# EAGLE schematic io (EAGLE 6.6.0)

## Sheet 1 of 2
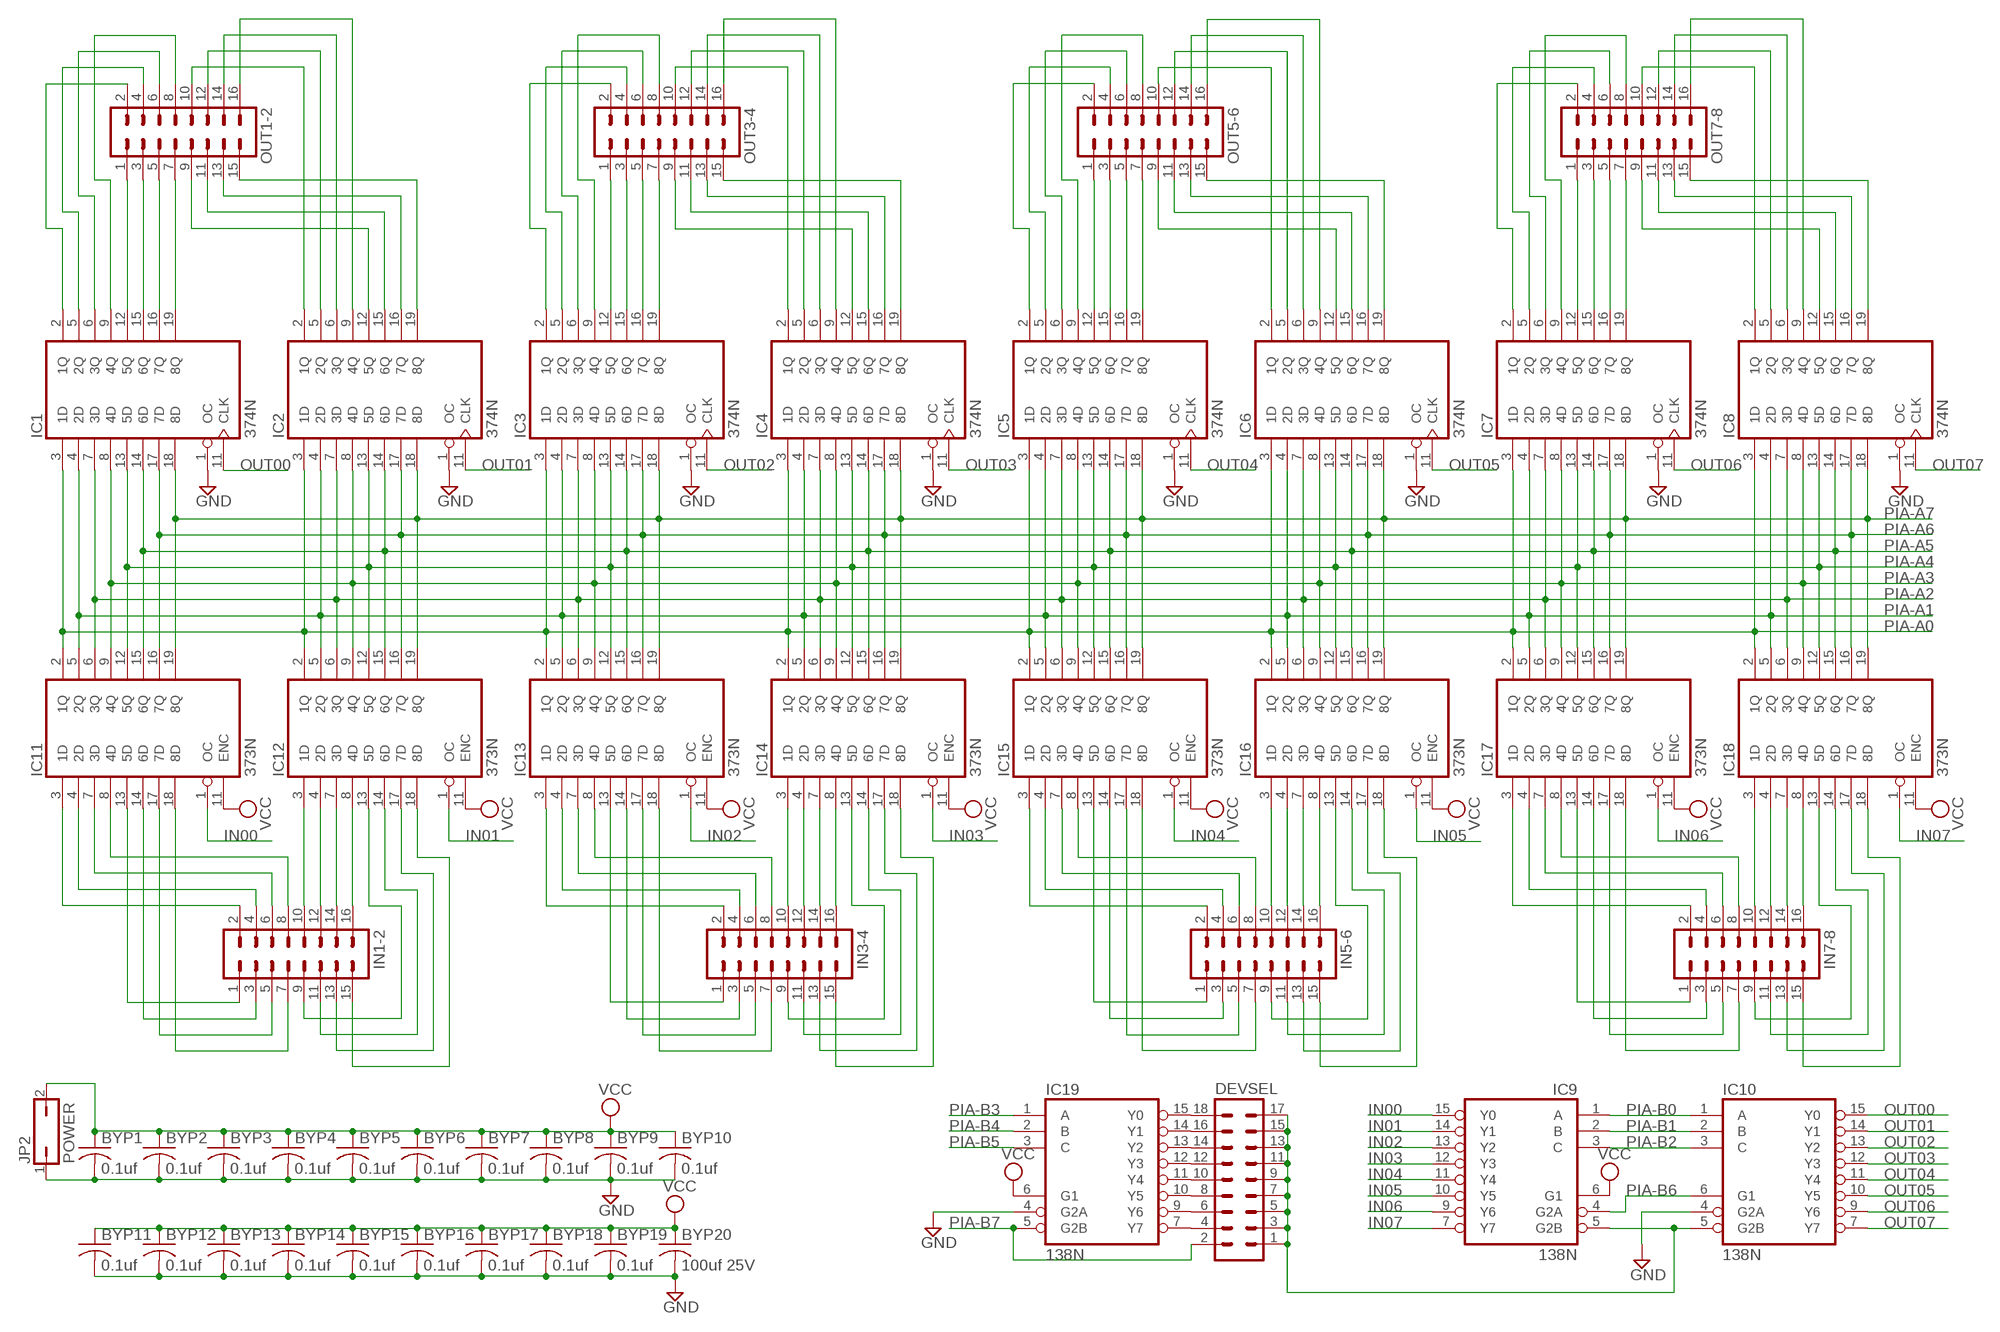
[diagram p0: schematic, sheet 1]

### Parts
BYP1  0.1uf  C-US050-025X075  [C050-025X075]
BYP2  0.1uf  C-US050-025X075  [C050-025X075]
BYP3  0.1uf  C-US050-025X075  [C050-025X075]
BYP4  0.1uf  C-US050-025X075  [C050-025X075]
BYP5  0.1uf  C-US050-025X075  [C050-025X075]
BYP6  0.1uf  C-US050-025X075  [C050-025X075]
BYP7  0.1uf  C-US050-025X075  [C050-025X075]
BYP8  0.1uf  C-US050-025X075  [C050-025X075]
BYP9  0.1uf  C-US050-025X075  [C050-025X075]
BYP10  0.1uf  C-US050-025X075  [C050-025X075]
BYP11  0.1uf  C-US050-025X075  [C050-025X075]
BYP12  0.1uf  C-US050-025X075  [C050-025X075]
BYP13  0.1uf  C-US050-025X075  [C050-025X075]
BYP14  0.1uf  C-US050-025X075  [C050-025X075]
BYP15  0.1uf  C-US050-025X075  [C050-025X075]
BYP16  0.1uf  C-US050-025X075  [C050-025X075]
BYP17  0.1uf  C-US050-025X075  [C050-025X075]
BYP18  0.1uf  C-US050-025X075  [C050-025X075]
BYP19  0.1uf  C-US050-025X075  [C050-025X075]
BYP20  100uf 25V  C-US150-064X183  [C150-064X183]
DEVSEL  MA09-2  [MA09-2]
IC1  374N  74LS374N  [DIL20]
IC2  374N  74LS374N  [DIL20]
IC3  374N  74LS374N  [DIL20]
IC4  374N  74LS374N  [DIL20]
IC5  374N  74LS374N  [DIL20]
IC6  374N  74LS374N  [DIL20]
IC7  374N  74LS374N  [DIL20]
IC8  374N  74LS374N  [DIL20]
IC9  138N  74LS138N  [DIL16]
IC10  138N  74LS138N  [DIL16]
IC11  373N  74LS373N  [DIL20]
IC12  373N  74LS373N  [DIL20]
IC13  373N  74LS373N  [DIL20]
IC14  373N  74LS373N  [DIL20]
IC15  373N  74LS373N  [DIL20]
IC16  373N  74LS373N  [DIL20]
IC17  373N  74LS373N  [DIL20]
IC18  373N  74LS373N  [DIL20]
IC19  138N  74LS138N  [DIL16]
IN1-2  MA08-2  [MA08-2]
IN3-4  MA08-2  [MA08-2]
IN5-6  MA08-2  [MA08-2]
IN7-8  MA08-2  [MA08-2]
JP2  POWER  JP1Q  [JP1]
OUT1-2  MA08-2  [MA08-2]
OUT3-4  MA08-2  [MA08-2]
OUT5-6  MA08-2  [MA08-2]
OUT7-8  MA08-2  [MA08-2]

### Nets
GND [Power]: BYP1.2 BYP2.2 BYP3.2 BYP4.2 BYP5.2 BYP6.2 BYP7.2 BYP8.2 BYP9.2 BYP10.2 BYP11.2 BYP12.2 BYP13.2 BYP14.2 BYP15.2 BYP16.2 BYP17.2 BYP18.2 BYP19.2 BYP20.2 IC1.1(OC) IC2.1(OC) IC3.1(OC) IC4.1(OC) IC5.1(OC) IC6.1(OC) IC7.1(OC) IC8.1(OC) IC10.4(G2A) IC19.4(G2A) JP2.1 ; also sheet 2
IN00: IC9.15(Y0) IC11.1(OC)
IN01: IC9.14(Y1) IC12.1(OC)
IN02: IC9.13(Y2) IC13.1(OC)
IN03: IC9.12(Y3) IC14.1(OC)
IN04: IC9.11(Y4) IC15.1(OC)
IN05: IC9.10(Y5) IC16.1(OC)
IN06: IC9.9(Y6) IC17.1(OC)
IN07: IC9.7(Y7) IC18.1(OC)
N$1: IC12.3(1D) IN1-2.10
N$2: IC12.4(2D) IN1-2.12
N$3: DEVSEL.18 IC19.15(Y0)
N$4: DEVSEL.16 IC19.14(Y1)
N$5: DEVSEL.14 IC19.13(Y2)
N$6: DEVSEL.12 IC19.12(Y3)
N$7: IC12.7(3D) IN1-2.14
N$8: IC12.8(4D) IN1-2.16
N$9: IC11.8(4D) IN1-2.8
N$10: IC11.7(3D) IN1-2.6
N$11: IC11.4(2D) IN1-2.4
N$12: IC11.3(1D) IN1-2.2
N$13: IC11.13(5D) IN1-2.1
N$14: IC11.14(6D) IN1-2.3
N$15: IC11.17(7D) IN1-2.5
N$16: IC11.18(8D) IN1-2.7
N$17: IC12.13(5D) IN1-2.9
N$18: IC12.14(6D) IN1-2.11
N$19: IC12.17(7D) IN1-2.13
N$20: IC12.18(8D) IN1-2.15
N$21: DEVSEL.10 IC19.11(Y4)
N$22: DEVSEL.8 IC19.10(Y5)
N$23: DEVSEL.6 IC19.9(Y6)
N$24: DEVSEL.4 IC19.7(Y7)
N$25: DEVSEL.1 DEVSEL.3 DEVSEL.5 DEVSEL.7 DEVSEL.9 DEVSEL.11 DEVSEL.13 DEVSEL.15 DEVSEL.17 IC9.5(G2B) IC10.5(G2B)
N$26: IC5.2(1Q) OUT5-6.2
N$27: IC18.8(4D) IN7-8.16
N$28: IC18.3(1D) IN7-8.10
N$29: IC14.3(1D) IN3-4.10
N$30: IC14.4(2D) IN3-4.12
N$31: IC14.7(3D) IN3-4.14
N$32: IC14.8(4D) IN3-4.16
N$33: IC3.12(5Q) OUT3-4.1
N$34: IC3.15(6Q) OUT3-4.3
N$35: IC3.16(7Q) OUT3-4.5
N$36: IC3.19(8Q) OUT3-4.7
N$37: IC13.3(1D) IN3-4.2
N$38: IC13.4(2D) IN3-4.4
N$39: IC13.7(3D) IN3-4.6
N$40: IC13.8(4D) IN3-4.8
N$41: IC14.13(5D) IN3-4.9
N$42: IC14.14(6D) IN3-4.11
N$43: IC14.17(7D) IN3-4.13
N$44: IC14.18(8D) IN3-4.15
N$45: IC13.13(5D) IN3-4.1
N$46: IC13.14(6D) IN3-4.3
N$47: IC13.17(7D) IN3-4.5
N$48: IC13.18(8D) IN3-4.7
N$49: IC3.5(2Q) OUT3-4.4
N$50: IC3.6(3Q) OUT3-4.6
N$51: IC3.2(1Q) OUT3-4.2
N$52: IC3.9(4Q) OUT3-4.8
N$53: IC1.12(5Q) OUT1-2.1
N$54: IC1.15(6Q) OUT1-2.3
N$55: IC1.16(7Q) OUT1-2.5
N$56: IC1.19(8Q) OUT1-2.7
N$57: IC1.2(1Q) OUT1-2.2
N$58: IC1.5(2Q) OUT1-2.4
N$59: IC1.6(3Q) OUT1-2.6
N$60: IC1.9(4Q) OUT1-2.8
N$61: IC2.19(8Q) OUT1-2.15
N$62: IC2.16(7Q) OUT1-2.13
N$63: IC2.15(6Q) OUT1-2.11
N$64: IC2.12(5Q) OUT1-2.9
N$65: IC2.2(1Q) OUT1-2.10
N$66: IC2.5(2Q) OUT1-2.12
N$67: IC2.6(3Q) OUT1-2.14
N$68: IC2.9(4Q) OUT1-2.16
N$69: IC4.2(1Q) OUT3-4.10
N$70: IC4.5(2Q) OUT3-4.12
N$71: IC4.6(3Q) OUT3-4.14
N$72: IC4.9(4Q) OUT3-4.16
N$73: IC4.19(8Q) OUT3-4.15
N$74: IC4.16(7Q) OUT3-4.13
N$75: IC4.15(6Q) OUT3-4.11
N$76: IC4.12(5Q) OUT3-4.9
N$77: IC16.3(1D) IN5-6.10
N$78: IC16.4(2D) IN5-6.12
N$79: IC16.7(3D) IN5-6.14
N$80: IC16.8(4D) IN5-6.16
N$81: IC5.12(5Q) OUT5-6.1
N$82: IC5.15(6Q) OUT5-6.3
N$83: IC5.16(7Q) OUT5-6.5
N$84: IC5.19(8Q) OUT5-6.7
N$85: IC7.12(5Q) OUT7-8.1
N$86: IC7.15(6Q) OUT7-8.3
N$87: IC7.16(7Q) OUT7-8.5
N$88: IC7.19(8Q) OUT7-8.7
N$89: IC5.5(2Q) OUT5-6.4
N$90: IC5.6(3Q) OUT5-6.6
N$91: IC5.9(4Q) OUT5-6.8
N$92: IC6.12(5Q) OUT5-6.9
N$93: IC6.15(6Q) OUT5-6.11
N$94: IC18.4(2D) IN7-8.12
N$95: IC6.16(7Q) OUT5-6.13
N$96: IC6.19(8Q) OUT5-6.15
N$97: IC6.2(1Q) OUT5-6.10
N$98: IC6.5(2Q) OUT5-6.12
N$99: IC6.6(3Q) OUT5-6.14
N$100: IC6.9(4Q) OUT5-6.16
N$101: IC15.3(1D) IN5-6.2
N$102: IC15.4(2D) IN5-6.4
N$103: IC15.7(3D) IN5-6.6
N$104: IC15.8(4D) IN5-6.8
N$105: IC16.13(5D) IN5-6.9
N$106: IC16.14(6D) IN5-6.11
N$107: IC16.17(7D) IN5-6.13
N$108: IC16.18(8D) IN5-6.15
N$109: IC15.13(5D) IN5-6.1
N$110: IC15.14(6D) IN5-6.3
N$111: IC15.17(7D) IN5-6.5
N$112: IC15.18(8D) IN5-6.7
N$113: IC8.19(8Q) OUT7-8.15
N$114: IC8.16(7Q) OUT7-8.13
N$115: IC8.15(6Q) OUT7-8.11
N$116: IC8.12(5Q) OUT7-8.9
N$117: IC8.2(1Q) OUT7-8.10
N$118: IC8.5(2Q) OUT7-8.12
N$119: IC8.6(3Q) OUT7-8.14
N$120: IC8.9(4Q) OUT7-8.16
N$121: IC7.9(4Q) OUT7-8.8
N$122: IC7.6(3Q) OUT7-8.6
N$123: IC7.5(2Q) OUT7-8.4
N$124: IC18.7(3D) IN7-8.14
N$125: IC18.13(5D) IN7-8.9
N$126: IC18.14(6D) IN7-8.11
N$127: IC18.17(7D) IN7-8.13
N$128: IC18.18(8D) IN7-8.15
N$129: IC17.3(1D) IN7-8.2
N$130: IC17.4(2D) IN7-8.4
N$131: IC17.7(3D) IN7-8.6
N$132: IC17.8(4D) IN7-8.8
N$133: IC17.13(5D) IN7-8.1
N$134: IC17.14(6D) IN7-8.3
N$135: IC17.17(7D) IN7-8.5
N$136: IC17.18(8D) IN7-8.7
N$137: IC7.2(1Q) OUT7-8.2
OUT00: IC1.11(CLK) IC10.15(Y0)
OUT01: IC2.11(CLK) IC10.14(Y1)
OUT02: IC3.11(CLK) IC10.13(Y2)
OUT03: IC4.11(CLK) IC10.12(Y3)
OUT04: IC5.11(CLK) IC10.11(Y4)
OUT05: IC6.11(CLK) IC10.10(Y5)
OUT06: IC7.11(CLK) IC10.9(Y6)
OUT07: IC8.11(CLK) IC10.7(Y7)
PIA-A0: IC1.3(1D) IC2.3(1D) IC3.3(1D) IC4.3(1D) IC5.3(1D) IC6.3(1D) IC7.3(1D) IC8.3(1D) IC11.2(1Q) IC12.2(1Q) IC13.2(1Q) IC14.2(1Q) IC15.2(1Q) IC16.2(1Q) IC17.2(1Q) IC18.2(1Q) ; also sheet 2
PIA-A1: IC1.4(2D) IC2.4(2D) IC3.4(2D) IC4.4(2D) IC5.4(2D) IC6.4(2D) IC7.4(2D) IC8.4(2D) IC11.5(2Q) IC12.5(2Q) IC13.5(2Q) IC14.5(2Q) IC15.5(2Q) IC16.5(2Q) IC17.5(2Q) IC18.5(2Q) ; also sheet 2
PIA-A2: IC1.7(3D) IC2.7(3D) IC3.7(3D) IC4.7(3D) IC5.7(3D) IC6.7(3D) IC7.7(3D) IC8.7(3D) IC11.6(3Q) IC12.6(3Q) IC13.6(3Q) IC14.6(3Q) IC15.6(3Q) IC16.6(3Q) IC17.6(3Q) IC18.6(3Q) ; also sheet 2
PIA-A3: IC1.8(4D) IC2.8(4D) IC3.8(4D) IC4.8(4D) IC5.8(4D) IC6.8(4D) IC7.8(4D) IC8.8(4D) IC11.9(4Q) IC12.9(4Q) IC13.9(4Q) IC14.9(4Q) IC15.9(4Q) IC16.9(4Q) IC17.9(4Q) IC18.9(4Q) ; also sheet 2
PIA-A4: IC1.13(5D) IC2.13(5D) IC3.13(5D) IC4.13(5D) IC5.13(5D) IC6.13(5D) IC7.13(5D) IC8.13(5D) IC11.12(5Q) IC12.12(5Q) IC13.12(5Q) IC14.12(5Q) IC15.12(5Q) IC16.12(5Q) IC17.12(5Q) IC18.12(5Q) ; also sheet 2
PIA-A5: IC1.14(6D) IC2.14(6D) IC3.14(6D) IC4.14(6D) IC5.14(6D) IC6.14(6D) IC7.14(6D) IC8.14(6D) IC11.15(6Q) IC12.15(6Q) IC13.15(6Q) IC14.15(6Q) IC15.15(6Q) IC16.15(6Q) IC17.15(6Q) IC18.15(6Q) ; also sheet 2
PIA-A6: IC1.17(7D) IC2.17(7D) IC3.17(7D) IC4.17(7D) IC5.17(7D) IC6.17(7D) IC7.17(7D) IC8.17(7D) IC11.16(7Q) IC12.16(7Q) IC13.16(7Q) IC14.16(7Q) IC15.16(7Q) IC16.16(7Q) IC17.16(7Q) IC18.16(7Q) ; also sheet 2
PIA-A7: IC1.18(8D) IC2.18(8D) IC3.18(8D) IC4.18(8D) IC5.18(8D) IC6.18(8D) IC7.18(8D) IC8.18(8D) IC11.19(8Q) IC12.19(8Q) IC13.19(8Q) IC14.19(8Q) IC15.19(8Q) IC16.19(8Q) IC17.19(8Q) IC18.19(8Q) ; also sheet 2
PIA-B0: IC9.1(A) IC10.1(A) ; also sheet 2
PIA-B1: IC9.2(B) IC10.2(B) ; also sheet 2
PIA-B2: IC9.3(C) IC10.3(C) ; also sheet 2
PIA-B3: IC19.1(A) ; also sheet 2
PIA-B4: IC19.2(B) ; also sheet 2
PIA-B5: IC19.3(C) ; also sheet 2
PIA-B6: IC9.4(G2A) IC10.6(G1) ; also sheet 2
PIA-B7: DEVSEL.2 IC19.5(G2B) ; also sheet 2
VCC [Power]: BYP1.1 BYP2.1 BYP3.1 BYP4.1 BYP5.1 BYP6.1 BYP7.1 BYP8.1 BYP9.1 BYP10.1 BYP11.1 BYP12.1 BYP13.1 BYP14.1 BYP15.1 BYP16.1 BYP17.1 BYP18.1 BYP19.1 BYP20.1 IC9.6(G1) IC11.11(ENC) IC12.11(ENC) IC13.11(ENC) IC14.11(ENC) IC15.11(ENC) IC16.11(ENC) IC17.11(ENC) IC18.11(ENC) IC19.6(G1) JP2.2 ; also sheet 2

## Sheet 2 of 2
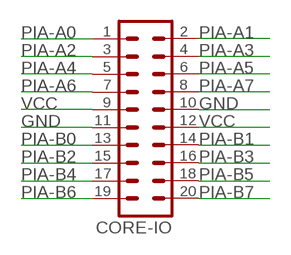
[diagram p1: schematic, sheet 2]

### Parts
CORE-IO  MA10-2  [MA10-2]

### Nets
GND [Power]: CORE-IO.10 CORE-IO.11 ; also sheet 1
PIA-A0: CORE-IO.1 ; also sheet 1
PIA-A1: CORE-IO.2 ; also sheet 1
PIA-A2: CORE-IO.3 ; also sheet 1
PIA-A3: CORE-IO.4 ; also sheet 1
PIA-A4: CORE-IO.5 ; also sheet 1
PIA-A5: CORE-IO.6 ; also sheet 1
PIA-A6: CORE-IO.7 ; also sheet 1
PIA-A7: CORE-IO.8 ; also sheet 1
PIA-B0: CORE-IO.13 ; also sheet 1
PIA-B1: CORE-IO.14 ; also sheet 1
PIA-B2: CORE-IO.15 ; also sheet 1
PIA-B3: CORE-IO.16 ; also sheet 1
PIA-B4: CORE-IO.17 ; also sheet 1
PIA-B5: CORE-IO.18 ; also sheet 1
PIA-B6: CORE-IO.19 ; also sheet 1
PIA-B7: CORE-IO.20 ; also sheet 1
VCC [Power]: CORE-IO.9 CORE-IO.12 ; also sheet 1

## Power pins joined to a net without a drawn wire
GND: IC1.10(GND) IC2.10(GND) IC3.10(GND) IC4.10(GND) IC5.10(GND) IC6.10(GND) IC7.10(GND) IC8.10(GND) IC9.8(GND) IC10.8(GND) IC11.10(GND) IC12.10(GND) IC13.10(GND) IC14.10(GND) IC15.10(GND) IC16.10(GND) IC17.10(GND) IC18.10(GND) IC19.8(GND)
VCC: IC1.20(VCC) IC2.20(VCC) IC3.20(VCC) IC4.20(VCC) IC5.20(VCC) IC6.20(VCC) IC7.20(VCC) IC8.20(VCC) IC9.16(VCC) IC10.16(VCC) IC11.20(VCC) IC12.20(VCC) IC13.20(VCC) IC14.20(VCC) IC15.20(VCC) IC16.20(VCC) IC17.20(VCC) IC18.20(VCC) IC19.16(VCC)

## Library data of the parts
BYP1-BYP20 = rcl:C-US: CAPACITOR, American symbol
CORE-IO = con-lstb:MA10-2: PIN HEADER; OC_FARNELL: unknown; OC_NEWARK: unknown
DEVSEL = con-lstb:MA09-2: PIN HEADER; OC_FARNELL: unknown; OC_NEWARK: unknown
IC1-IC8 = 74xx-us:74*374: Octal D type transparent LATCH, edge triggered
IC9 IC10 IC19 = 74xx-us:74*138: 3-line to 8-line DECODER/DEMULTIPLEXER
IC11-IC18 = 74xx-us:74*373: Octal D type transparent LATCH, edge triggered
IN1-2 IN3-4 IN5-6 IN7-8 OUT1-2 OUT3-4 OUT5-6 OUT7-8 = con-lstb:MA08-2: PIN HEADER; OC_FARNELL: unknown; OC_NEWARK: unknown
JP2 = jumper:JP1Q: JUMPER

## Net classes
1 Power: width 0.508 mm, drill 0.254 mm, clearance 0.254 mm